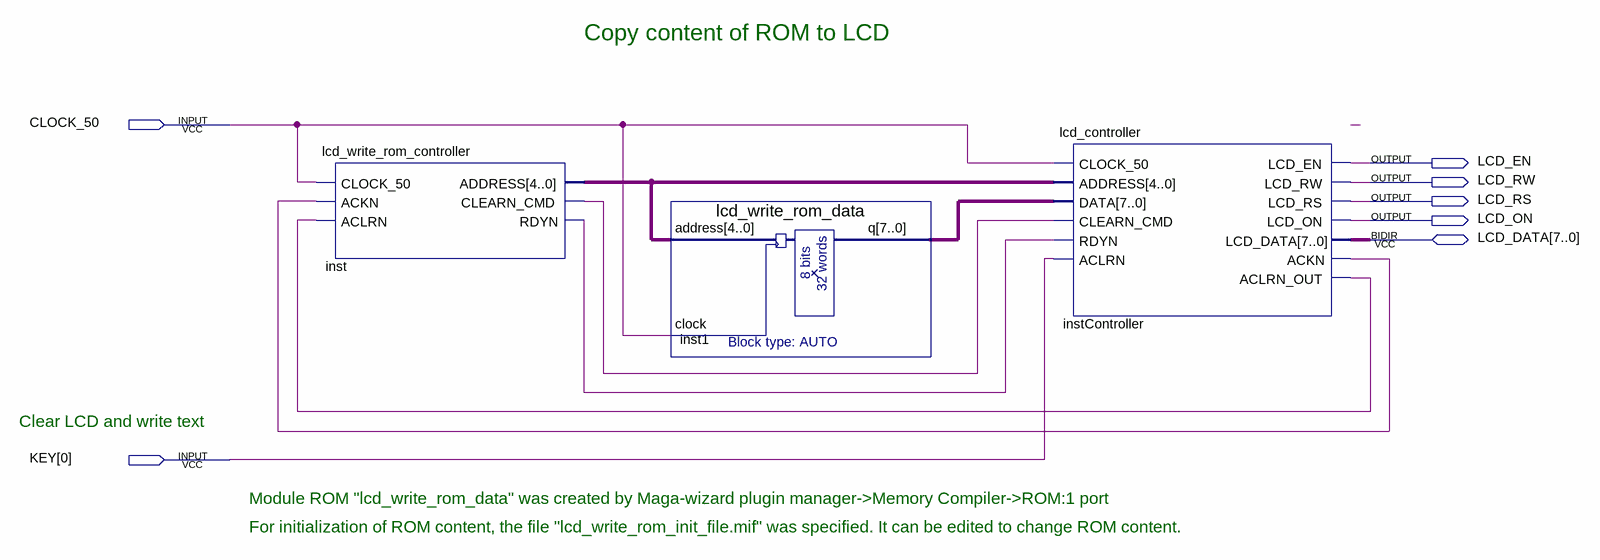
[diagram p0: schematic sheet]
// Quartus schematic lcd_demo_rom.bdf as structural Verilog: 3 symbols, 7 pins
module lcd_demo_rom (
  input  CLOCK_50,
  input  [0:0] KEY,
  inout  [7:0] LCD_DATA,
  output LCD_EN,
  output LCD_RW,
  output LCD_RS,
  output LCD_ON
);

  wire inst_clearn_cmd, inst_rdyn, instController_ackn, instController_aclrn_out;
  wire [4:0] inst_address;
  wire [7:0] inst1_q;

  lcd_write_rom_controller inst (
    .CLOCK_50(CLOCK_50), .ACKN(instController_ackn), .ACLRN(instController_aclrn_out),
    .ADDRESS(inst_address), .CLEARN_CMD(inst_clearn_cmd), .RDYN(inst_rdyn));
  lcd_write_rom_data inst1 (.address(inst_address), .clock(CLOCK_50), .q(inst1_q));
  lcd_controller instController (
    .CLOCK_50(CLOCK_50), .ADDRESS(inst_address), .DATA(inst1_q), .CLEARN_CMD(inst_clearn_cmd),
    .RDYN(inst_rdyn), .ACLRN(KEY[0]), .LCD_EN(LCD_EN), .LCD_RW(LCD_RW), .LCD_RS(LCD_RS), .LCD_ON(LCD_ON),
    .ACKN(instController_ackn), .ACLRN_OUT(instController_aclrn_out), .LCD_DATA(LCD_DATA));

  // Notes on the sheet:
  //   Copy content of ROM to LCD 
  //   Clear LCD and write text
  //   Module ROM "lcd_write_rom_data" was created by Maga-wizard plugin manager->Memory Compiler->ROM:1 port
  //   For initialization of ROM content, the file "lcd_write_rom_init_file.mif" was specified. It can be edited to change ROM content.
endmodule
